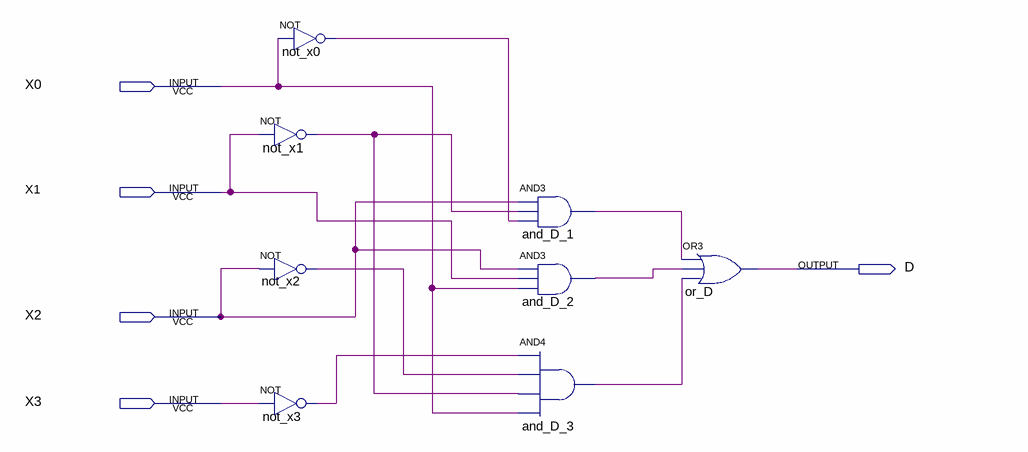
[diagram p0: schematic sheet]
// Quartus schematic dec_segmento_D.bdf as structural Verilog: 8 symbols, 5 pins
module dec_segmento_D (
  input  X0,
  input  X1,
  input  X2,
  input  X3,
  output D
);

  wire and_D_1_out, and_D_2_out, and_D_3_out, not_x0_out, not_x1_out, not_x2_out, not_x3_out;

  not not_x0 (not_x0_out, X0);
  not not_x1 (not_x1_out, X1);
  not not_x2 (not_x2_out, X2);
  not not_x3 (not_x3_out, X3);
  and and_D_1 (and_D_1_out, X2, not_x1_out, not_x0_out);
  and and_D_2 (and_D_2_out, X2, X1, X0);
  and and_D_3 (and_D_3_out, not_x3_out, not_x2_out, not_x1_out, X0);
  or or_D (D, and_D_1_out, and_D_2_out, and_D_3_out);
endmodule
